# Altium schematic sheet Power Supply.SchDoc
size A
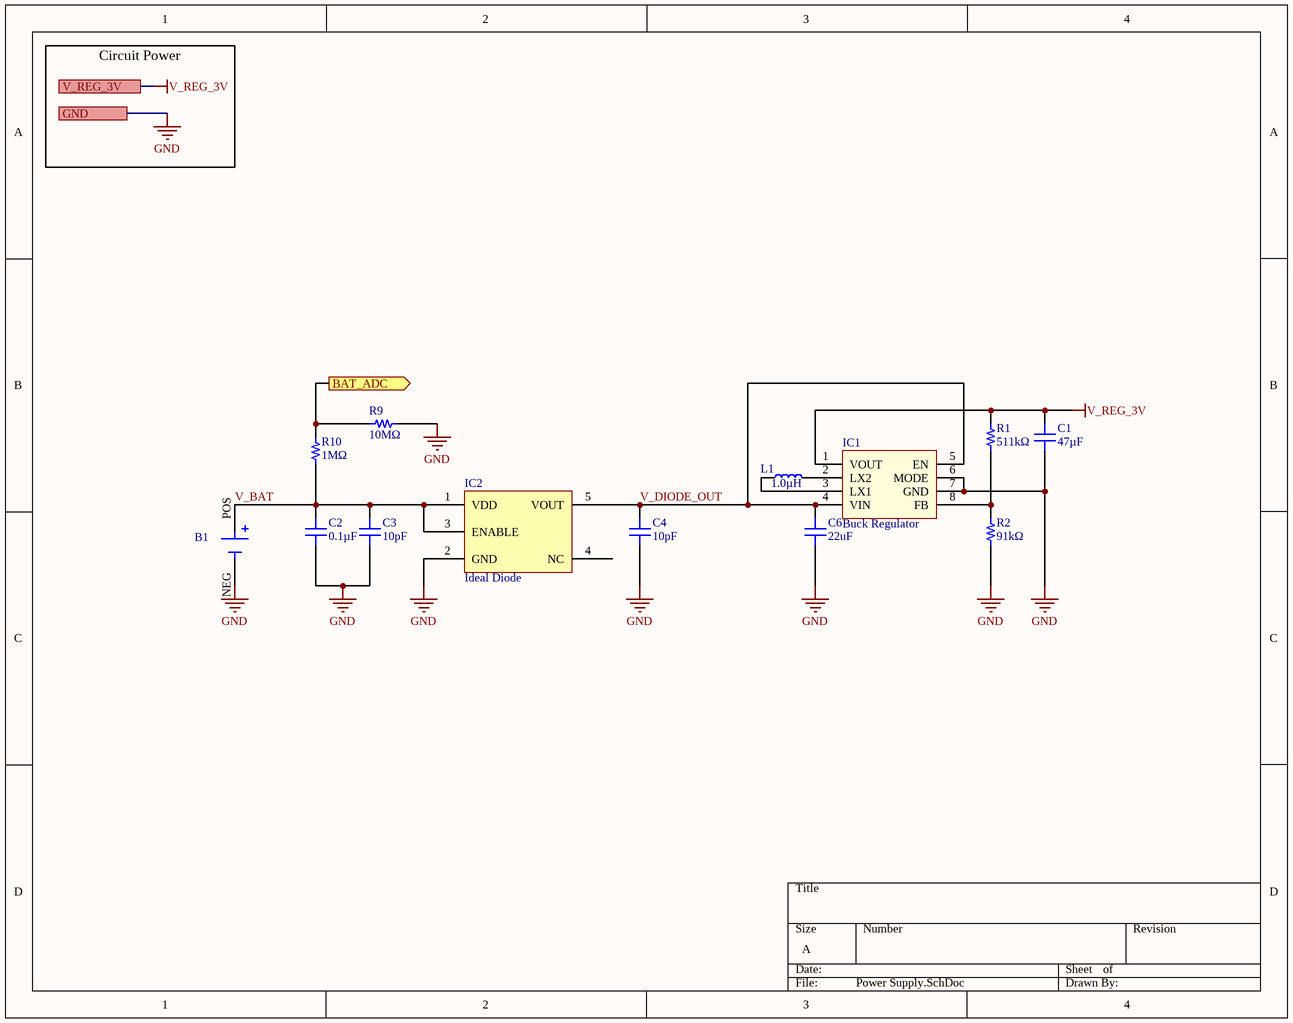
[diagram p0: Power Supply.SchDoc]

## Parts
B1  24.5mm Coin Cell (×1)  [MPD BHAA-3]  (value not drawn)
C1  47µF  [CAP 0805_2012]
C2  0.1µF  [CAP 0402_1005]
C3  10pF  [CAP 0603_1608]
C4  10pF  [CAP 0603_1608]
C6  22uF  [CAP 0402_1005]
IC1  Buck Regulator  [TI SOT-583]
IC2  Ideal Diode  [MAXIM SOT-23-5]
L1  1.0µH  [NTC 0603_1608]
R1  511kΩ  [RES 0402_1005 RF]
R2  91kΩ  [RES 0402_1005 RF]
R9  10MΩ  [RES 0603_1608 RF]
R10  1MΩ  [RES 0603_1608 RF]

## Ports
BAT_ADC (out), GND, V_REG_3V

## Nets
GND: B1.NEG C1.1 C2.1 C3.1 C4.1 C6.1 IC1.6(MODE) IC1.7(GND) IC2.2(GND) R2.1 R9.2 ; port GND
V_REG_3V: C1.2 IC1.1(VOUT) R1.2 ; port V_REG_3V
BAT_ADC: R9.1 R10.2 ; port BAT_ADC
V_BAT: B1.POS C2.2 C3.2 IC2.1(VDD) IC2.3(ENABLE) R10.1
V_DIODE_OUT: C4.2 C6.2 IC1.4(VIN) IC1.5(EN) IC2.5(VOUT)
NetIC1_2: IC1.2(LX2) L1.2
NetIC1_3: IC1.3(LX1) L1.1
NetIC1_8: IC1.8(FB) R1.1 R2.2

Not connected (* = marked no-connect by the designer): IC2 4(NC)

## Notes on the sheet
- Circuit Power

## Library data of the parts
B1 = BCL00006: BATTERY HOLDER AA PIN; Manufacturer: MPD (Memory Protection Devices); Manufacturer P/N: BHAA-3‎; Number of Cells: 1; Style: PC Pin; Device ID: BCL00006; Part Type: Battery Holder; VALUE: 24.5mm Coin Cell (×1); Operating Temperature: -55°C ~ 105°C; Battery Cell Size: AA; Supplier1: Digi-Key; Supplier1 P/N: BHAA-3-ND; Supplier2: -; Supplier2 P/N: -; Mounting Type: Through Hole
C1 = CAP00052: CAP CER 47UF 50V X7R 0805; Manufacturer: KEMET; Manufacturer P/N: C0805C223K5RAC7210; Tolerance: ±20%; Device ID: CAP00052; Mounting Type: Surface Mount; Part Type: Capacitor; VALUE: 47µF; Operating Temperature: -55°C ~ 125°C; Voltage: 50V; Package: 0805 (2012 Metric); Supplier1: Digi-Key; Supplier1 P/N: 399-C0805C223K5RAC7210CT-ND; Supplier2: Mouser; Supplier2 P/N: 80-C0805C223K5RACLR; Temperature Coefficient: X7R
C2 = CAP00001: CAP CER 0.1UF 16V X7R 0402; Manufacturer: KEMET; Manufacturer P/N: C0402C104K4RAC7411; Tolerance: ±10%; Device ID: CAP00001; Mounting Type: Surface Mount; Part Type: Capacitor; VALUE: 0.1µF; Operating Temperature: -55°C ~ 125°C; Voltage: 16V; Package: 0402 (1005 Metric); Supplier1: Digi-Key; Supplier1 P/N: 399-C0402C104K4RAC7411CT-ND; Supplier2: Mouser; Supplier2 P/N: 80-C0402C104K4R7411; Temperature Coefficient: X7R
C3 C4 = CAP00050: CAP CER 10UF 6.3V X5R 0603; Manufacturer: KEMET; Manufacturer P/N: CL10A106MQ8NNNC; Tolerance: ±20%; Device ID: CAP00050; Mounting Type: Surface Mount; Part Type: Capacitor; VALUE: 10pF; Operating Temperature: -55°C ~ 125°C; Voltage: 6.3V; Package: 0603 (1608 Metric); Supplier1: Digi-Key; Supplier1 P/N: 1276-1119-2-ND; Supplier2: Mouser; Supplier2 P/N: 187-CL10A106MQ8NNNC; Temperature Coefficient: X5R
C6 = CAP00053: CAP CER 22UF 50V NPO 0402; Manufacturer: Walsin; Manufacturer P/N: 0402N9R0B500CT; Tolerance: ±0.1%; Temperature Coefficient: C0G, NP0; Device ID: CAP00053; Mounting Type: Surface Mount; Part Type: Capacitor; VALUE: 22uF; Operating Temperature: -55°C ~ 125°C; Voltage: 50V; Package: 0402 (1005 Metric); Supplier1: Digi-Key; Supplier1 P/N: 1292-0402N9R0B500CTTR-ND; Supplier2: Mouser; Supplier2 P/N: 791-0402N9R0B500CT
IC1 = VRG00007: DC DC CONVERTER; Manufacturer: Texas Instruments; Manufacturer P/N: TPS631000DRLR; Voltage - Input (Max): 5.5V; Voltage - Input (Min): 1.6V; Voltage - Output (Max): 5.3V; Current - Output: 2A; Number of Outputs: 1; Voltage - Output (Min/Fixed): 1.2V; Function: Step-Down; Device ID: VRG00007; Part Type: IC; VALUE: Buck Regulator; Operating Temperature: -40°C ~ 125°C (TJ); Package: SOT-583; Supplier1: Digi-Key; Supplier1 P/N: 296-TPS631000DRLRTR-ND; Synchronous Rectifier: -; Supplier2: Mouser; Supplier2 P/N: 595-TPS631000DRLR; Mounting Type: Surface Mount; Frequency - Switching: -
IC2 = DCN00002: IC IDEAL DIODE; Manufacturer: Texas Instruments; Manufacturer P/N: LM66100DCKR; FET Type: P-Channel; Ratio - Input:Output: 1:1; Internal Switch(s): Yes; Current - Output (Max): 1.5A; Voltage - Supply: 1.5V ~ 5.5V; Delay Time - ON: 27 µs; Delay Time - OFF: 2 µs; Device ID: DCN00002; Part Type: IC; VALUE: Ideal Diode; Operating Temperature: -40°C ~ 105°C; Package: SOT-363; Mounting Type: Surface Mount; Applications: General Purpose; Supplier1: Digi-Key; Supplier1 P/N: 296-53541-1-ND; Supplier2: Mouser; Supplier2 P/N: 595-LM66100DCKR
L1 = IND00005: FIXED IND 1.0UH 16V; Manufacturer: TDK Corporation; Manufacturer P/N: C2012X5R1C106K; Current Saturation: 90mA; Tolerance: ±20%; DC Resistance: 1.050Ω; Material - Core: Ferrite; Device ID: IND00005; Part Type: Inductor; VALUE: 1.0µH; Operating Temperature: -55°C ~ 125°C; Package: 0603 (1608 Metric); Supplier1: Digi-Key; Supplier1 P/N: 445-175588-1-ND; Supplier2: Mouser; Supplier2 P/N: 810-MLZ1608M100WTD25; Q @ Freq: -; Frequency - Self Resonant: -; Mounting Type: Surface Mount
R1 = RES0003C: RES SMD 4.7K OHM 1% 1/8W 0402; Manufacturer: YAGEO; Manufacturer P/N: AC0402FR-7W4K7L; Power: 0.125W; Device ID: RES0003C; VALUE: 511kΩ; Mounting Type: Surface Mount; Part Type: Resistor; Operating Temperature: -55°C ~ 155°C; Package: 0402 (1005 Metric); Tolerance: ±1%; Composition: Thick Film; Supplier1: Digi-Key; Supplier1 P/N: 603-AC0402FR-7W4K7L; Supplier2: Mouser; Supplier2 P/N: 603-AC0402FR-7W4K7L
R2 = RES0003D: RES SMD 4.7K OHM 1% 1/8W 0402; Manufacturer: YAGEO; Manufacturer P/N: AC0402FR-7W4K7L; Power: 0.125W; Device ID: RES0003D; VALUE: 91kΩ; Mounting Type: Surface Mount; Part Type: Resistor; Operating Temperature: -55°C ~ 155°C; Package: 0402 (1005 Metric); Tolerance: ±1%; Composition: Thick Film; Supplier1: Digi-Key; Supplier1 P/N: 603-AC0402FR-7W4K7L; Supplier2: Mouser; Supplier2 P/N: 603-AC0402FR-7W4K7L
R9 = RES0003F: RES 10M OHM 1% 1/10W 0603; Manufacturer: Vishay Dale; Manufacturer P/N: ‎CRCW0603820KFKEAC‎; Power: 0.100W; Device ID: RES0003F; VALUE: 10MΩ; Mounting Type: Surface Mount; Part Type: Resistor; Operating Temperature: -55°C ~ 155°C; Package: 0603 (1608 Metric); Tolerance: ±1%; Composition: Thick Film; Supplier1: Digi-Key; Supplier1 P/N: ‎541-5568-1-ND‎; Supplier2: Mouser; Supplier2 P/N: 71-CRCW0603820KFKEAC
R10 = RES0003E: RES 1M OHM 1% 1/10W 0603; Manufacturer: Vishay Dale; Manufacturer P/N: ‎CRCW0603820KFKEAC‎; Power: 0.100W; Device ID: RES0003E; VALUE: 1MΩ; Mounting Type: Surface Mount; Part Type: Resistor; Operating Temperature: -55°C ~ 155°C; Package: 0603 (1608 Metric); Tolerance: ±1%; Composition: Thick Film; Supplier1: Digi-Key; Supplier1 P/N: ‎541-5568-1-ND‎; Supplier2: Mouser; Supplier2 P/N: 71-CRCW0603820KFKEAC